# Altium schematic sheet in-amp.SchDoc
size 420 x 297 mm; Organization: Develer s.r.l.; Address1: via Mugellese 1/A; Address2: 50019 Campi Bisenzio; Address3: Firenze; Address4: ITALY; Revision: A; SheetNumber: 1; SheetTotal: 1; PageSetup: Record=PageOptions|CenterHorizontal=True|CenterVertical=True|PrintScale=0.70|XCorrection=1.00|YCorrection=1.00|PrintKind=1|BorderSize=5000000|LeftOffset=0|BottomOffset=0|Orientation=2|PaperLength=1000|PaperWidth=1000|Scale=100|PaperSource=15|PrintQuality=1200|MediaType=1|DitherType=10|PaperKind=A4|PrintScaleMode=1
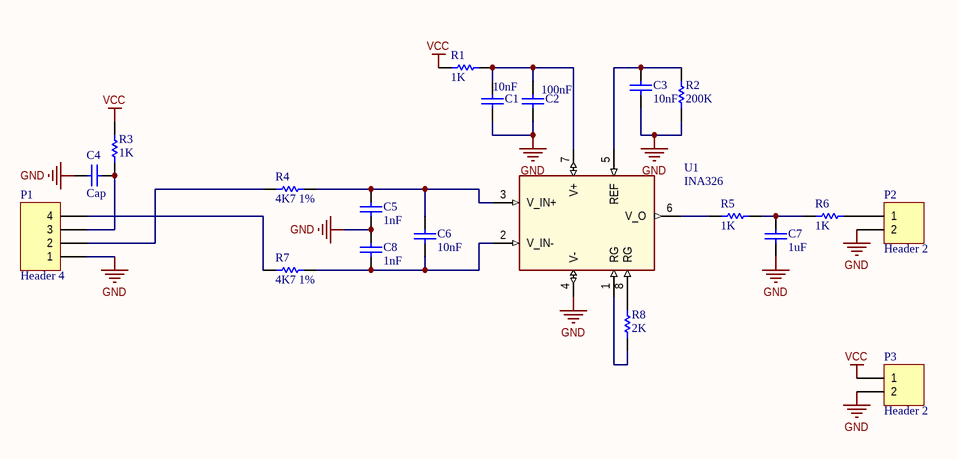
[diagram p0: in-amp.SchDoc]

## Parts
C1  10nF  [6-0805_L]
C2  100nF  [6-0805_L]
C3  10nF  [6-0805_L]
C4  Cap  [6-0805_L]
C5  1nF  [6-0805_L]
C6  10nF  [6-0805_L]
C7  1uF  [6-0805_L]
C8  1nF  [6-0805_L]
P1  Header 4  [HDR1X4]
P2  Header 2  [HDR1X2]
P3  Header 2  [HDR1X2]
R1  1K  [1210]
R2  200K  [6-0805_L]
R3  1K  [1210]
R4  4K7 1%  [6-0805_L]
R5  1K  [6-0805_L]
R6  1K  [6-0805_L]
R7  4K7 1%  [6-0805_L]
R8  2K  [6-0805_L]
U1  INA326  [MSOP8]

## Nets
GND: C1.1 C2.1 C3.1 C4.2 C5.1 C7.1 C8.2 P1.1 P2.2 P3.2 R2.2 U1.4(V-)
VCC: P3.1 R1.1 R3.2
NetC1_2: C1.2 C2.2 R1.2 U1.7(V+)
NetC3_2: C3.2 R2.1 U1.5(REF)
NetC4_1: C4.1 P1.3 R3.1
NetC5_2: C5.2 C6.2 R4.1 U1.3(V_IN+)
NetC6_1: C6.1 C8.1 R7.1 U1.2(V_IN-)
NetC7_2: C7.2 R5.1 R6.2
NetP1_2: P1.2 R4.2
NetP1_4: P1.4 R7.2
NetP2_1: P2.1 R6.1
NetR5_2: R5.2 U1.6(V_O)
NetR8_1: R8.1 U1.1(RG)
NetR8_2: R8.2 U1.8(RG)

## Notes on the sheet
- Title:
- Author:
- Size:
- A3
- Approved:
- Rev:
- Date:
- Time:
- Sheet
- of

## Library data of the parts
C1-C8 = Cap: Capacitor; Value: 100pF; Published: 8-Jun-2000; LatestRevisionDate: 17-Jul-2002; LatestRevisionNote: Re-released for DXP Platform.; PackageReference: RAD-0.3; Publisher: Altium Limited; PackageDescription: Radial Cap, Thru-Hole; 2 Leads; 0.3 in Pin Spacing
P1 = Header 4: Header, 4-Pin; LatestRevisionDate: 17-Jul-2002; LatestRevisionNote: Re-released for DXP Platform.; Publisher: Altium Limited
P2 P3 = Header 2: Header, 2-Pin; LatestRevisionDate: 17-Jul-2002; LatestRevisionNote: Re-released for DXP Platform.; Publisher: Altium Limited
R1 R3 R5 R6 = Res1: Resistor; Published: 8-Jun-2000; LatestRevisionDate: 17-Jul-2002; LatestRevisionNote: Re-released for DXP Platform.; PackageReference: AXIAL-0.3; Publisher: Altium Limited; PackageDescription: Axial Device, Thru-Hole; 2 Leads; 0.3 in Pin Spacing; Value: 1K
R2 R4 R7 R8 = Res1: Resistor; Value: 1K; Published: 8-Jun-2000; LatestRevisionDate: 17-Jul-2002; LatestRevisionNote: Re-released for DXP Platform.; PackageReference: AXIAL-0.3; Publisher: Altium Limited; PackageDescription: Axial Device, Thru-Hole; 2 Leads; 0.3 in Pin Spacing
U1 = INA326: in-amp